# Altium project matilanza.PrjPCB
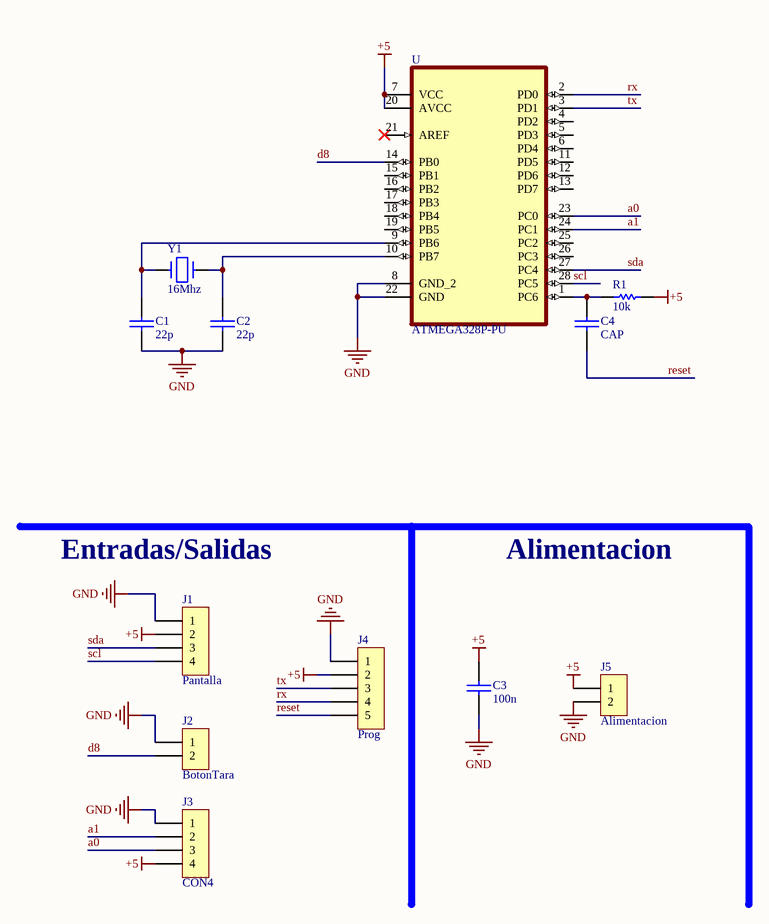
[diagram p0: esquematico.SchDoc]
1 sheet, 12 parts. Net scope: global (net labels, ports and power ports of the same name join across sheets).
Board file: pcb.PcbDoc

## Sheet esquematico.SchDoc
size A

### Parts
C1  22p  [CAP200]
C2  22p  [CAP200]
C3  100n  [CAP200]
C4  CAP  [CAP200]
J1  Pantalla  [SIP4]
J2  BotonTara  [SIP2]
J3  CON4  [SIP4]
J4  Prog  [SIP5]
J5  Alimentacion  [BORNERA2]
R1  10k  [RES400]
U  ATMEGA328P-PU  [DIP254P762X457-28]
Y1  16Mhz  [CRISTAL PERFIL]

### Nets
+5: C3.1 J1.2 J3.4 J4.2 J5.1 R1.2 U.7(VCC) U.20(AVCC)
GND: C1.2 C2.2 C3.2 J1.1 J2.1 J3.1 J4.1 J5.2 U.8(GND_2) U.22(GND)
a0: J3.3 U.23(PC0)
a1: J3.2 U.24(PC1)
d8: J2.2 U.14(PB0)
reset: C4.2 J4.5
rx: J4.4 U.2(PD0)
scl: J1.4 U.28(PC5)
sda: J1.3 U.27(PC4)
tx: J4.3 U.3(PD1)
NetC1_1: C1.1 U.9(PB6) Y1.1
NetC2_1: C2.1 U.10(PB7) Y1.2
NetC4_1: C4.1 R1.1 U.1(PC6)

Not connected (* = marked no-connect by the designer): U 4(PD2) 5(PD3) 6(PD4) 11(PD5) 12(PD6) 13(PD7) 15(PB1) 16(PB2) 17(PB3) 18(PB4) 19(PB5) 21(AREF)* 25(PC2) 26(PC3)

### Notes on the sheet
- Entradas/Salidas
- Alimentacion

### Library data of the parts
C1-C3 = CAP
J1 = CON4
J2 = CON2
J4 = CON5
J5 = BORNERA 2
R1 = RES
U = ATMEGA328P-PU: AVR AVRÂ® ATmega Microcontroller IC 8-Bit 20MHz 32KB _16K x 16_ FLASH 28-PDIP; MF: Microchip; Package: PDIP-28 Microchip; Value: *; MP: ATMEGA328P-PU; Price: None; SnapEDA_Link: https://www.snapeda.com/parts/ATMEGA328P-PU/Microchip/view-part/649476/?ref=snap; Availability: Unavailable
Y1 = CRISTAL